# EAGLE design train-controller (EAGLE 7.4.0)
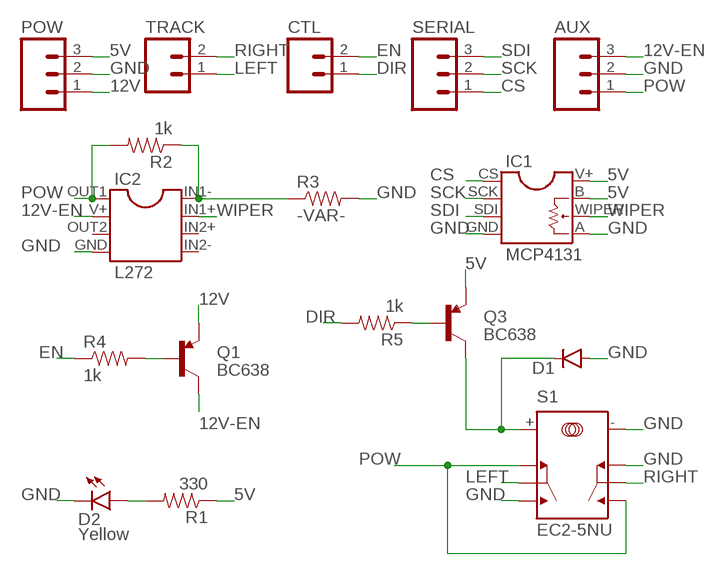
[diagram p0: schematic, sheet 1]

## Parts
AUX  M03PTH  [1X03]
CTL  M02PTH  [1X02]
D1  DIODE1N4148  [DIODE-1N4148]
D2  Yellow  LED-YELLOW0603  [LED-EDGE]
IC1  MCP4131  [MCP4131]
IC2  L272  [L272]
POW  M03PTH  [1X03]
Q1  BC638  TRANSISTOR_PNPTO92  [TO-92]
Q3  BC638  TRANSISTOR_PNPTO92  [TO-92]
R1  330  1KOHM-1/4W-5%(PTH)  [AXIAL-0.3]
R2  1k  1KOHM-1/4W-5%(PTH)  [AXIAL-0.3]
R3  -VAR-  1KOHM-1/4W-5%(PTH)  [AXIAL-0.3]
R4  1k  1KOHM-1/4W-5%(PTH)  [AXIAL-0.3]
R5  1k  1KOHM-1/4W-5%(PTH)  [AXIAL-0.3]
S1  EC2-5NU  [EC2-5NU]
SERIAL  M03PTH  [1X03]
TRACK  M02PTH  [1X02]

## Nets
5V: IC1.B IC1.V+ POW.3 Q3.1(E) R1.P$1
12V: POW.1 Q1.1(E)
12V-EN: AUX.3 IC2.V+ Q1.3(C)
CS: IC1.CS SERIAL.1
DIR: CTL.1 R5.P$2
EN: CTL.2 R4.P$1
GND: AUX.2 D1.A D2.C IC1.A IC1.GND IC2.GND POW.2 R3.P$2 S1.- S1.NC2 S1.NO1
LEFT: S1.COM1 TRACK.1
N$1: Q1.2(B) R4.P$2
N$2: D1.C Q3.3(C) S1.+
N$3: IC2.IN1- R2.P$1 R3.P$1
N$5: Q3.2(B) R5.P$1
N$19: D2.A R1.P$2
POW: AUX.1 IC2.OUT1 R2.P$2 S1.NC1 S1.NO2
RIGHT: S1.COM2 TRACK.2
SCK: IC1.SCK SERIAL.2
SDI: IC1.SDI SERIAL.3
WIPER: IC1.WIPER IC2.IN1+
Unconnected: IC2.IN2+ IC2.IN2- IC2.OUT2

## Library data of the parts
AUX POW SERIAL = SparkFun-Connectors:M03: Header 3 Standard 3-pin 0.1" header. Use with straight break away headers (SKU : PRT-00116), right angle break away headers (PRT-00553), swiss pins (PRT-00743), machine pins (PRT-00117), and female headers (PRT-00115). Molex polarized connector foot print use with SKU : PRT-08232 with associated crimp pins and housings.
CTL TRACK = SparkFun-Connectors:M02: Standard 2-pin 0.1" header. Use with - straight break away headers ( PRT-00116) - right angle break away headers (PRT-00553) - swiss pins (PRT-00743) - machine pins (PRT-00117) - female headers (PRT-00115) Molex polarized connector foot print use with: PRT-08233 with associated crimp pins and housings. 2.54_SCREWTERM for use with PRT-10571. 3.5mm Screw Terminal footprints for PRT-08084 5mm Screw Terminal footprints for use with PRT-08432
D1 = SparkFun-DiscreteSemi:DIODE: Diode These are standard reverse protection diodes and small signal diodes. SMA package can handle up to about 1A. SOD-323 can handle about 200mA. What the SOD-323 package when ordering, there are some mfgs out there that are 5-pin packages.
D2 = custom-parts:LED-YELLOW: Yellow SMD LEDs LilyPad 1206- DIO-09909 0603- DIO-09003 "SMART" means more efficient and expensive; PROD_ID: DIO-09003
IC1 = custom-parts:MCP4131
IC2 = custom-parts:L272
Q1 Q3 = custom-parts:TRANSISTOR_PNP: Generic PNP BJT Double check pinouts against datasheets- not all devices are the same! MMBT3906 - 40V 200mA SOT-23 (TRANS-08052) MMBT4403 - 40V 600mA SOT-23 (TRANS-09245)
R1-R5 = SparkFun-Resistors:1KOHM-1/4W-5%(PTH): RES-08380; PROD_ID: RES-08380; VALE: 1k
S1 = custom-parts:EC2-5NU

## Board
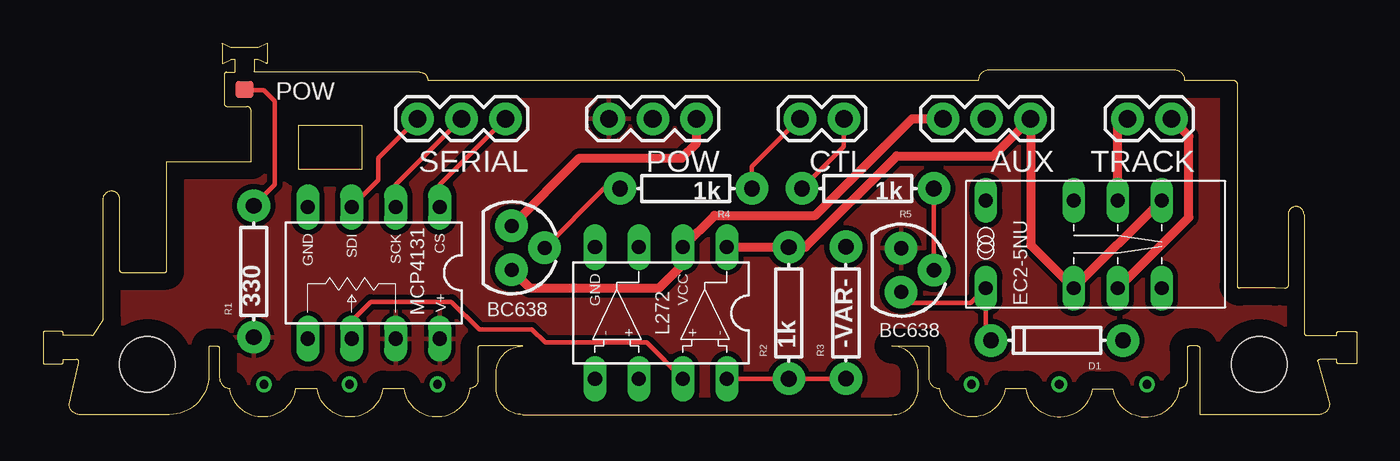
[diagram p1: board, top side]
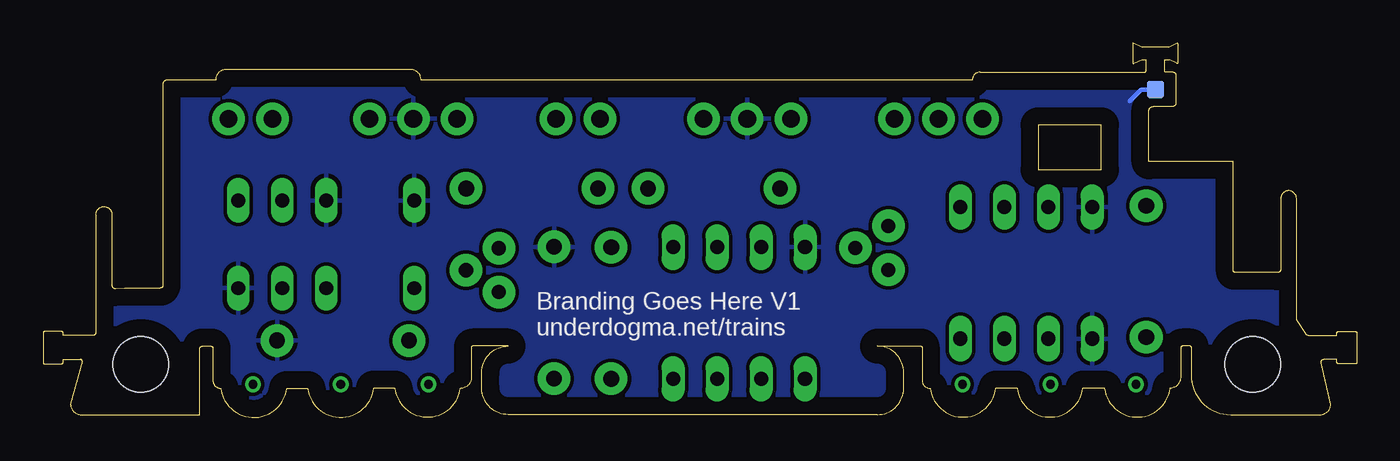
[diagram p2: board, bottom side, seen from below]

Size 75.92 x 21.65 mm. Coordinates in mm from the lower left corner, seen from the top.
Outline: 73.66,3.23 74.35,0.77 arc-90 73.74,0.16 66.88,0.16 66.88,3.96 arc90 66.72,4.12 66.23,4.12 arc90 66.12,4.01 66.12,2.14 arc-90 65.66,1.68
Outline: 10.79,1.68 arc-90 10.19,2.29 10.19,4.01 arc90 10.07,4.12 9.63,4.12 arc90 9.58,4.07 9.58,2.45 arc-90 7.29,0.16 2.11,0.16 arc-90 1.5,0.77 2.06,3.16 arc103 1.91,3.36 1.18,3.36 arc90 1.14,3.33 1.14,3.16 arc-90 1.09,3.11 0.06,3.11 arc-90 0,3.16 0,4.9 arc-90 0.06,4.96 1.09,4.96 arc-90 1.14,4.9 1.14,4.76 arc90 1.17,4.73 2.79,4.73 arc56 2.91,4.8 3.47,5.63 arc34 3.48,5.66 3.48,12.66 arc-90 3.94,13.11 arc-90 4.39,12.66 4.39,8.56 arc101 4.61,8.38 5.16,8.39 7.04,8.39 arc90 7.14,8.49 7.14,14.79 12.01,14.79 12.01,17.74 arc90 11.76,17.99 10.63,17.99 arc-90 10.46,18.15 10.46,19.82 arc-90 10.61,19.97 11.04,19.97 arc90 11.1,20.03 11.1,20.67 arc90 11.06,20.71 10.85,20.71 10.39,20.48 arc-117 10.34,20.51 10.34,21.62 arc-117 10.38,21.64 10.85,21.41 12.43,21.41 12.92,21.65 arc-117 12.94,21.63 12.94,20.52 arc-117 12.89,20.48 12.43,20.71 12.23,20.71 arc90 12.19,20.67 12.19,20.03 arc90 12.25,19.97 21.77,19.97 arc-90 22.22,19.52 54.08,19.52 arc-90 54.69,20.13 65.35,20.13 arc-90 65.96,19.52 68.76,19.52 arc-90 69.01,19.26 69.01,7.63 arc90 69.16,7.48 71.2,7.48 71.74,7.47 arc101 71.96,7.65 71.96,11.74 arc-90 72.42,12.2 arc-90 72.87,11.74 72.87,4.94 arc90 73.08,4.73 73.13,4.73 74.75,4.73 arc90 74.78,4.76 74.78,4.9 arc-90 74.83,4.96 75.86,4.96 arc-90 75.92,4.9 75.92,3.16 arc-90 75.86,3.11 74.83,3.11 arc-90 74.78,3.16 74.78,3.33 arc90 74.74,3.36 73.79,3.36 arc90 73.66,3.23
Outline: 14.58,1.68 15.82,1.68
Outline: 19.63,1.68 20.85,1.68
Outline: 24.66,1.68 arc90 25.12,2.14 25.12,4.05 arc-90 25.19,4.12 27.71,4.12 arc90 26.19,2.6 26.19,1.68 arc90 27.71,0.16 49.05,0.16 arc90 50.57,1.68 50.57,2.6 arc90 49.05,4.12 51.11,4.12 arc-90 51.18,4.05 51.18,2.29 arc90 51.79,1.68
Outline: 55.6,1.68 56.82,1.68
Outline: 60.63,1.66 61.85,1.66
Outline: 14.58,1.68 arc-165 10.78,1.68
Outline: 19.63,1.68 arc-165 15.83,1.68
Outline: 24.66,1.68 arc-165 20.86,1.68
Outline: 55.6,1.68 arc-165 51.81,1.68
Outline: 60.63,1.66 arc-165 56.82,1.68
Outline: 65.66,1.68 arc-165 61.84,1.66
Outline: 14.76,16.92 18.41,16.92 18.41,14.33 14.76,14.33 14.76,16.92
Copper layers (1*16): Top 0.035mm / dielectric 1.5mm / Bottom 0.035mm
Design rules "default": minimum track width 10mil, minimum drill 24mil, track to track 8mil, track to pad 8mil, pad to pad 8mil, via to via 8mil, smd to smd 8mil, copper to edge 40mil, drill to drill 8mil, minimum pad ring 10mil, minimum via ring 8mil, stop-mask expansion 4mil, vias tented up to drill 0mil, thermal gap 10mil
Holes 3.2 mm at 70.28,3.06 6.02,3.06

### Footprints (pad centres in the part's own frame; a part is rotated, then mirrored left to right if it is on the bottom)
1X03 = drill 1.016 pad 1.88: 1 0,0; 2 2.54,0; 3 5.08,0
1X02 = drill 1.016 pad 1.88: 1 0,0; 2 2.54,0
DIODE-1N4148 = drill 0.9 pad 1.88: A -3.81,0; C 3.81,0
LED-EDGE = smd 1 x 1 bottom: A 0,0.012 | smd 1 x 1: C 0,0.013
MCP4131 = drill 0.813 long: A 3.81,3.81; B -1.27,3.81; CS -3.81,-3.81; GND 3.81,-3.81; SCK -1.27,-3.81; SDI 1.27,-3.81; V+ -3.81,3.81; WIPER 1.27,3.81
L272 = drill 0.813 long: GND 3.81,-3.81; IN1+ -1.27,3.81; IN1- -3.81,3.81; IN2+ 1.27,3.81; IN2- 3.81,3.81; OUT1 -3.81,-3.81; OUT2 1.27,-3.81; V+ -1.27,-3.81
TO-92 = drill 0.813 pad 1.88: 1 -1.27,0; 2 0,1.905; 3 1.27,0
AXIAL-0.3 = drill 0.9 pad 1.88: P$1 -3.81,0; P$2 3.81,0
EC2-5NU = drill 0.8 long: + -6.35,-2.54; - -6.35,2.54; COM1 1.27,-2.54; COM2 1.27,2.54; NC1 -1.27,-2.54; NC2 -1.27,2.54; NO1 3.81,-2.54; NO2 3.81,2.54

### Placement (x,y rotation side)
AUX  57.07,17.28 180 top
CTL  46.28,17.28 180 top
D1  58.6,4.45 180 top
D2  11.63,18.96 0 bottom
IC1  19.1,8.37 180 top
IC2  35.7,6.04 180 top
POW  37.77,17.28 180 top
Q1  27.08,9.81 270 top
Q3  49.58,8.52 270 top
R1  12.17,8.44 90 top
R2  43.09,6.04 90 top
R3  46.39,6.05 90 top
R4  37.15,13.24 180 top
R5  47.66,13.24 180 top
S1  60.83,10.02 0 top
SERIAL  26.72,17.28 180 top
TRACK  65.2,17.28 180 top

### Tracks (layer width: path | path; a pad name or v marks a point on that pad's centre or on a via)
5V
  pour Top (isolate 0.305): -3.86,23.12 82.58,23.12 82.58,6.33 82.58,-3.55 -4.83,-3.55 -4.83,23.1 -3.86,23.1
12V
  Top 0.508: POW.1 37.77,15.88 36.88,14.99 30.99,14.99 Q1.1
12V-EN
  Top 0.508: AUX.3 50.22,17.28 44.63,11.69 38.81,11.69 IC2.V+ 37.01,9.81 37.01,8.9 35.61,7.5 28.12,7.5 Q1.3
CS
  Top 0.254: IC1.CS 22.91,13.47 SERIAL.1
DIR
  Top 0.254: CTL.1 46.28,15.67 R5.P$2
EN
  Top 0.254: R4.P$1 40.96,14.5 CTL.2
GND
  Bottom 0.254: D2.C 12.46,18.97 13.13,18.3
  pour Bottom: 0.43,0.16 0.43,23.02 79.53,23.02 arc90 79.68,23.17 79.68,0.16
LEFT
  Top 0.508: S1.COM1 62.13,7.48 66.22,11.57 66.22,16.26 TRACK.1
N$1
  Top 0.254: R4.P$2 32.41,13.24 Q1.2
N$2
  Top 0.254: D1.C 54.48,4.76 S1.+ 53.62,6.61 50.22,6.61 Q3.3
N$3
  Top 0.254: IC2.IN1- R2.P$1 43.1,2.24 R3.P$1
N$5
  Top 0.254: R5.P$1 51.47,8.53 Q3.2
N$8  (via drill 0.5)
  other vias: 12.75,1.91
N$9  (via drill 0.5)
  other vias: 17.7,1.91
N$10  (via drill 0.5)
  other vias: 22.78,1.91
N$11  (via drill 0.5)
  other vias: 53.64,1.91
N$12  (via drill 0.5)
  other vias: 58.72,1.91
N$13  (via drill 0.5)
  other vias: 63.8,1.91
N$19
  Top 0.254: R1.P$2 13.39,13.47 13.39,18.3 12.75,18.93 11.67,18.93 D2.A
POW
  Top 0.508: S1.NO2 S1.NC1 57.07,9.97 AUX.1 54.91,15.12 49.33,15.12 44.06,9.85 R2.P$2 IC2.OUT1
RIGHT
  Top 0.508: S1.COM2 62.1,16.72 TRACK.2
SCK
  Top 0.254: IC1.SCK 20.37,13.47 SERIAL.2
SDI
  Top 0.254: IC1.SDI 17.83,12.2 19.35,13.72 19.35,14.99 SERIAL.3
WIPER
  Top 0.254: IC1.WIPER 17.83,5.6 18.92,6.69 23.6,6.69 25.2,5.09 28.24,5.09 29.01,4.33 34.87,4.33 IC2.IN1+

### Text on the board
tPlace: POW | MCP4131 | BC638 | EC2-5NU | L272 | BC638
bPlace: Branding Goes Here V1 / underdogma.net/trains